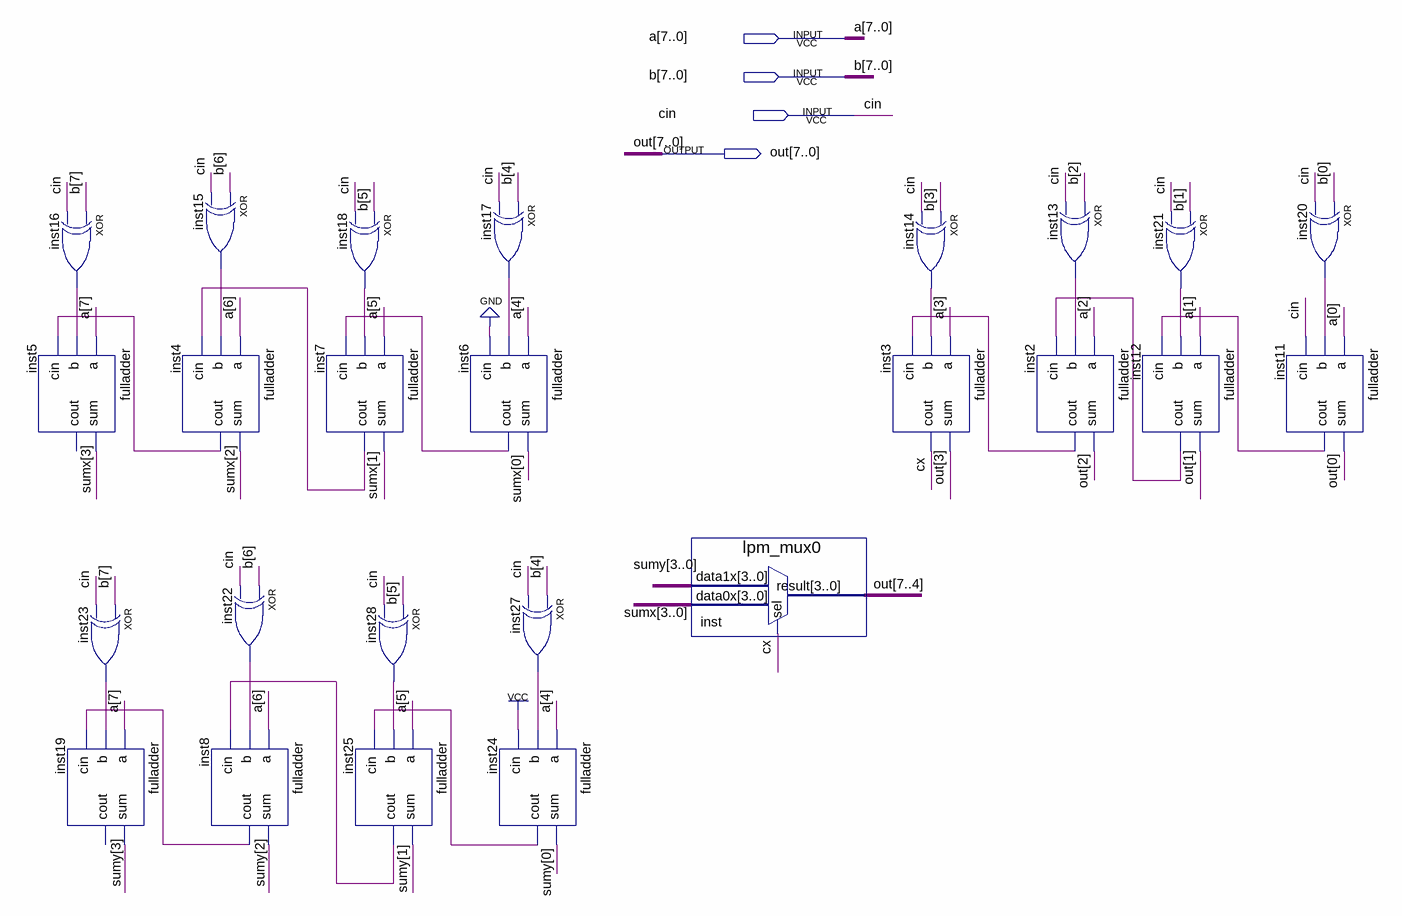
[diagram p0: schematic sheet]
// Quartus schematic CSA.bdf as structural Verilog: 25 symbols, 4 pins
module CSA (
  input  [7:0] a,
  input  [7:0] b,
  input  cin,
  output [7:0] out
);

  wire cx, inst2_cout, inst4_cout, inst6_cout, inst7_cout, inst8_cout, inst11_cout, inst12_cout, inst13_out,
       inst14_out, inst15_out, inst16_out, inst17_out, inst18_out, inst20_out, inst21_out, inst22_out,
       inst23_out, inst24_cout, inst25_cout, inst27_out, inst28_out;
  wire [3:0] sumx, sumy;

  xor inst16 (inst16_out, b[7], cin);
  fulladder inst5 (.a(a[7]), .b(inst16_out), .cin(inst4_cout), .sum(sumx[3]));  // open: cout
  xor inst23 (inst23_out, b[7], cin);
  fulladder inst19 (.a(a[7]), .b(inst23_out), .cin(inst8_cout), .sum(sumy[3]));  // open: cout
  xor inst15 (inst15_out, b[6], cin);
  fulladder inst4 (.a(a[6]), .b(inst15_out), .cin(inst7_cout), .sum(sumx[2]), .cout(inst4_cout));
  xor inst22 (inst22_out, b[6], cin);
  fulladder inst8 (.a(a[6]), .b(inst22_out), .cin(inst25_cout), .sum(sumy[2]), .cout(inst8_cout));
  fulladder inst7 (.a(a[5]), .b(inst18_out), .cin(inst6_cout), .sum(sumx[1]), .cout(inst7_cout));
  xor inst18 (inst18_out, b[5], cin);
  xor inst28 (inst28_out, b[5], cin);
  fulladder inst25 (.a(a[5]), .b(inst28_out), .cin(inst24_cout), .sum(sumy[1]), .cout(inst25_cout));
  fulladder inst6 (.a(a[4]), .b(inst17_out), .cin(1'b0), .sum(sumx[0]), .cout(inst6_cout));
  xor inst17 (inst17_out, b[4], cin);
  xor inst27 (inst27_out, b[4], cin);
  fulladder inst24 (.a(a[4]), .b(inst27_out), .cin(1'b1), .sum(sumy[0]), .cout(inst24_cout));
  lpm_mux0 inst (.data1x(sumy), .data0x(sumx), .sel(cx), .result(out[7:4]));
  xor inst14 (inst14_out, b[3], cin);
  fulladder inst3 (.a(a[3]), .b(inst14_out), .cin(inst2_cout), .sum(out[3]), .cout(cx));
  xor inst13 (inst13_out, b[2], cin);
  fulladder inst2 (.a(a[2]), .b(inst13_out), .cin(inst12_cout), .sum(out[2]), .cout(inst2_cout));
  xor inst21 (inst21_out, b[1], cin);
  fulladder inst12 (.a(a[1]), .b(inst21_out), .cin(inst11_cout), .sum(out[1]), .cout(inst12_cout));
  xor inst20 (inst20_out, b[0], cin);
  fulladder inst11 (.a(a[0]), .b(inst20_out), .cin(cin), .sum(out[0]), .cout(inst11_cout));
endmodule
